# EAGLE design PCB-BI8-1x6SC3 (EAGLE 7.5.0)
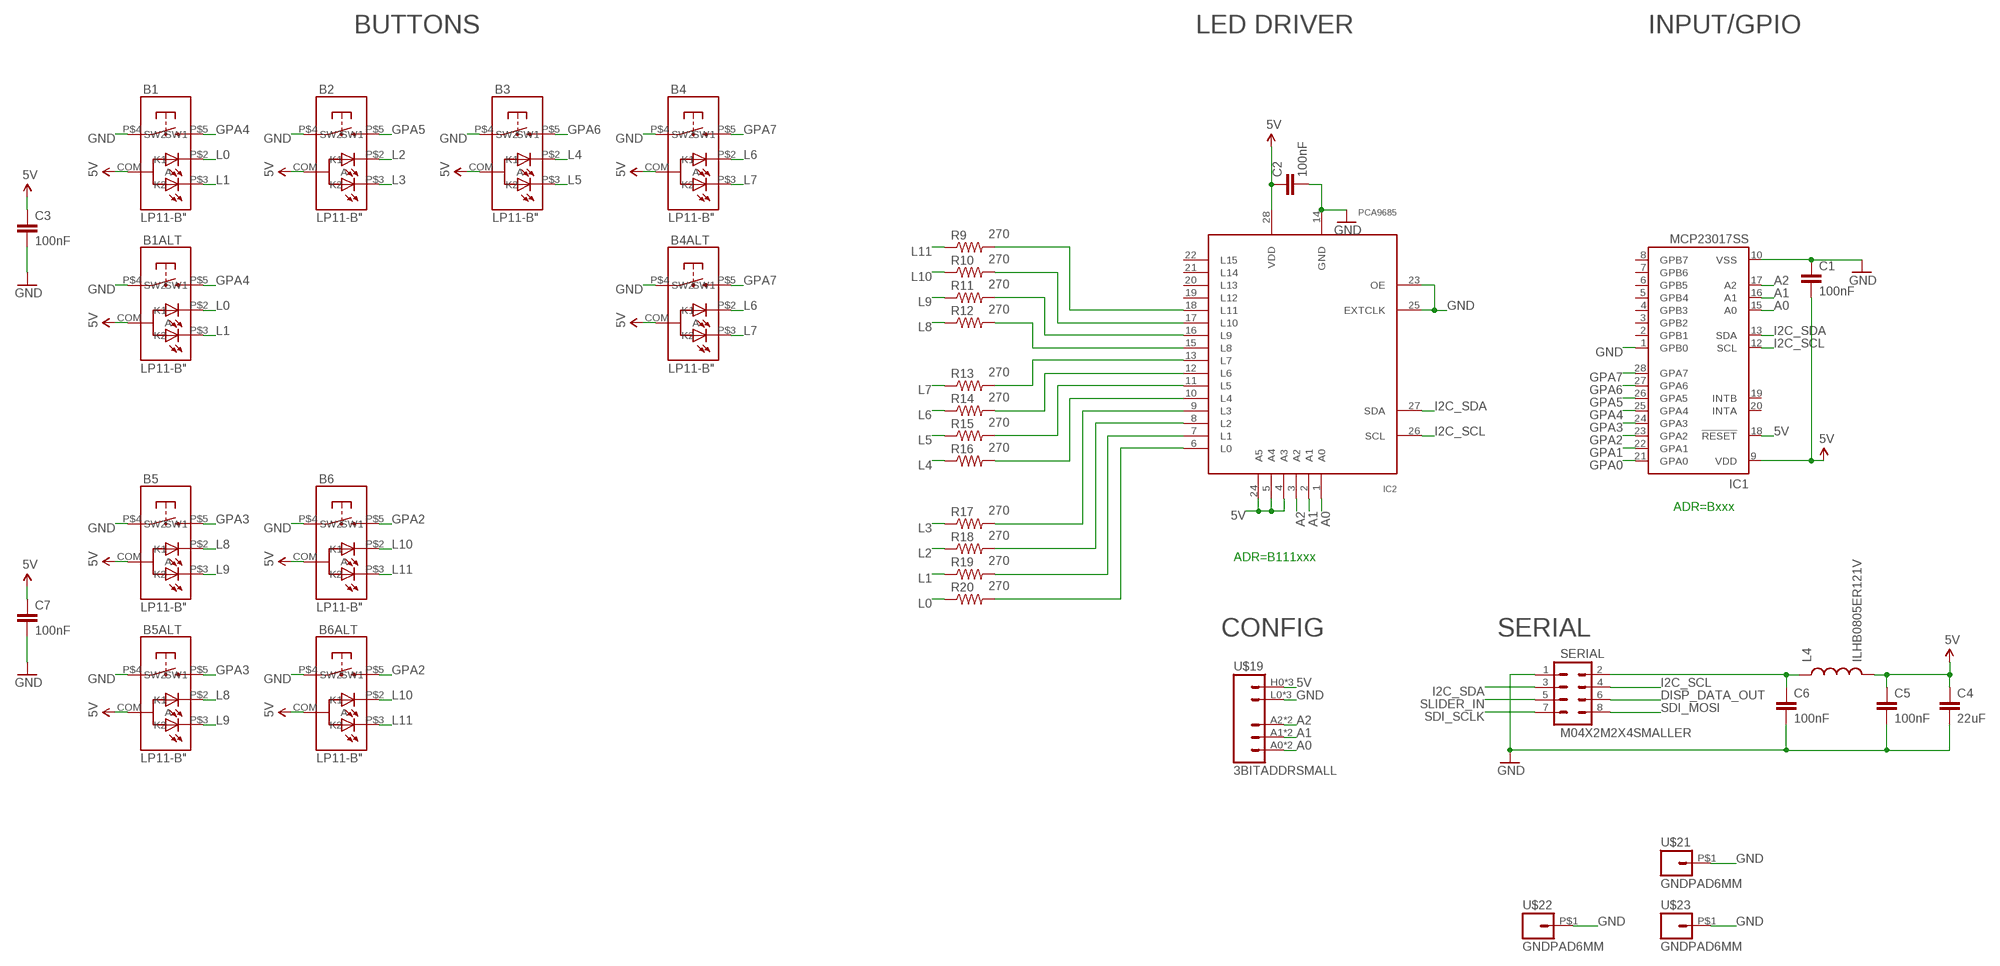
[diagram p0: schematic, sheet 1]

## Parts
B1  LP11-B"  [LP11]
B1ALT  LP11-B"  [LP11]
B2  LP11-B"  [LP11]
B3  LP11-B"  [LP11]
B4  LP11-B"  [LP11]
B4ALT  LP11-B"  [LP11]
B5  LP11-B"  [LP11]
B5ALT  LP11-B"  [LP11]
B6  LP11-B"  [LP11]
B6ALT  LP11-B"  [LP11]
C1  100nF  CAP0603-CAP  [0603-CAP]
C2  100nF  CAP0603-CAP  [0603-CAP]
C3  100nF  CAP0603-CAP  [0603-CAP]
C4  22uF  CAP0805  [0805]
C5  100nF  CAP0603-CAP  [0603-CAP]
C6  100nF  CAP0603-CAP  [0603-CAP]
C7  100nF  CAP0603-CAP  [0603-CAP]
IC1  MCP23017SS  [SSOP28]
IC2  PCA9685  [TSSOP28]
L4  ILHB0805ER121V  INDUCTOR0805  [0805]
R9  270  RESISTOR0603-RES  [0603-RES]
R10  270  RESISTOR0603-RES  [0603-RES]
R11  270  RESISTOR0603-RES  [0603-RES]
R12  270  RESISTOR0603-RES  [0603-RES]
R13  270  RESISTOR0603-RES  [0603-RES]
R14  270  RESISTOR0603-RES  [0603-RES]
R15  270  RESISTOR0603-RES  [0603-RES]
R16  270  RESISTOR0603-RES  [0603-RES]
R17  270  RESISTOR0603-RES  [0603-RES]
R18  270  RESISTOR0603-RES  [0603-RES]
R19  270  RESISTOR0603-RES  [0603-RES]
R20  270  RESISTOR0603-RES  [0603-RES]
SERIAL  M04X2M2X4SMALLER  [M2X4SMALLER]
U$19  3BITADDRSMALL  [3BITADDR_SMALL]
U$21  GNDPAD6MM  [3.2MMPAD6MM]
U$22  GNDPAD6MM  [3.2MMPAD6MM]
U$23  GNDPAD6MM  [3.2MMPAD6MM]

## Nets
5V [Power]: B1.COM(A) B1ALT.COM(A) B2.COM(A) B3.COM(A) B4.COM(A) B4ALT.COM(A) B5.COM(A) B5ALT.COM(A) B6.COM(A) B6ALT.COM(A) C1.2 C2.1 C3.1 C4.1 C5.1 C7.1 IC1.9(VDD) IC1.18(!RESET) IC2.4(A3) IC2.5(A4) IC2.24(A5) IC2.28(VDD) L4.2 U$19.H0(VCC) U$19.H1(VCC) U$19.H2(VCC)
A0: IC1.15(A0) IC2.1(A0) U$19.A0 U$19.AS0(A0)
A1: IC1.16(A1) IC2.2(A1) U$19.A1 U$19.AS1(A1)
A2: IC1.17(A2) IC2.3(A2) U$19.A2 U$19.AS2(A2)
DISP_DATA_OUT: SERIAL.6
GND [Power]: B1.P$4(SW1) B1ALT.P$4(SW1) B2.P$4(SW1) B3.P$4(SW1) B4.P$4(SW1) B4ALT.P$4(SW1) B5.P$4(SW1) B5ALT.P$4(SW1) B6.P$4(SW1) B6ALT.P$4(SW1) C1.1 C2.2 C3.2 C4.2 C5.2 C6.2 C7.2 IC1.1(GPB0) IC1.10(VSS) IC2.14(GND) IC2.23(OE) IC2.25(EXTCLK) SERIAL.1 U$19.L0(GND) U$19.L1(GND) U$19.L2(GND) U$21.P$1 U$22.P$1 U$23.P$1
GPA0: IC1.21(GPA0)
GPA1: IC1.22(GPA1)
GPA2: B6.P$5(SW2) B6ALT.P$5(SW2) IC1.23(GPA2)
GPA3: B5.P$5(SW2) B5ALT.P$5(SW2) IC1.24(GPA3)
GPA4: B1.P$5(SW2) B1ALT.P$5(SW2) IC1.25(GPA4)
GPA5: B2.P$5(SW2) IC1.26(GPA5)
GPA6: B3.P$5(SW2) IC1.27(GPA6)
GPA7: B4.P$5(SW2) B4ALT.P$5(SW2) IC1.28(GPA7)
I2C_SCL: IC1.12(SCL) IC2.26(SCL) SERIAL.4
I2C_SDA: IC1.13(SDA) IC2.27(SDA) SERIAL.3
L0: B1.P$2(K1) B1ALT.P$2(K1) R20.1
L1: B1.P$3(K2) B1ALT.P$3(K2) R19.1
L2: B2.P$2(K1) R18.1
L3: B2.P$3(K2) R17.1
L4: B3.P$2(K1) R16.1
L5: B3.P$3(K2) R15.1
L6: B4.P$2(K1) B4ALT.P$2(K1) R14.1
L7: B4.P$3(K2) B4ALT.P$3(K2) R13.1
L8: B5.P$2(K1) B5ALT.P$2(K1) R12.1
L9: B5.P$3(K2) B5ALT.P$3(K2) R11.1
L10: B6.P$2(K1) B6ALT.P$2(K1) R10.1
L11: B6.P$3(K2) B6ALT.P$3(K2) R9.1
N$1 [Power]: C6.1 L4.1 SERIAL.2
N$4: IC2.13(L7) R13.2
N$5: IC2.12(L6) R14.2
N$7: IC2.11(L5) R15.2
N$9: IC2.10(L4) R16.2
N$10: IC2.9(L3) R17.2
N$11: IC2.8(L2) R18.2
N$12: IC2.7(L1) R19.2
N$19: IC2.6(L0) R20.2
N$20: IC2.15(L8) R12.2
N$21: IC2.16(L9) R11.2
N$22: IC2.17(L10) R10.2
N$23: IC2.18(L11) R9.2
SDI_MOSI: SERIAL.8
SDI_SCLK: SERIAL.7
SLIDER_IN: SERIAL.5
Unconnected: IC1.2(GPB1) IC1.3(GPB2) IC1.4(GPB3) IC1.5(GPB4) IC1.6(GPB5) IC1.7(GPB6) IC1.8(GPB7) IC1.19(INTB) IC1.20(INTA) IC2.19(L12) IC2.20(L13) IC2.21(L14) IC2.22(L15)

## Notes on the sheet
- BUTTONS | LED DRIVER | INPUT/GPIO
- ADR=Bxxx
- ADR=B111xxx
- CONFIG | SERIAL

## Library data of the parts
B1 B1ALT B2-B4 B4ALT B5 B5ALT B6 B6ALT = SKAARHOJ:LP11-B
C1-C7 = SparkFun:CAP: Capacitor Standard 0603 ceramic capacitor, and 0.1" leaded capacitor.
IC1 = microchip:MCP23017: http://ww1.microchip.com/downloads/en/DeviceDoc/21952a.pdf Source: http://ww1.microchip.com/downloads/en/DeviceDoc/21952a.pdf; MF: MICROCHIP; MPN: MCP23017-E/SS; OC_FARNELL: 1467674; OC_NEWARK: 31K2960
IC2 = wsmith:PCA9685
L4 = SparkFun:INDUCTOR: Inductors Basic Inductor/Choke - 0603 and 1206. Footprints are not proven and vary greatly between part numbers.
R9-R20 = SparkFun:RESISTOR: Resistor Basic schematic elements and footprints for 0603, 1206, and PTH resistors.
SERIAL = SKAARHOJ:M04X2
U$19 = SKAARHOJ:3BITADDR
U$21-U$23 = SKAARHOJ:GNDPAD

## Net classes
0 default: width 0.203 mm, drill 0.406 mm, clearance 0.203 mm
1 Power: width 0.406 mm, drill 0.61 mm, clearance 0.203 mm

## Board
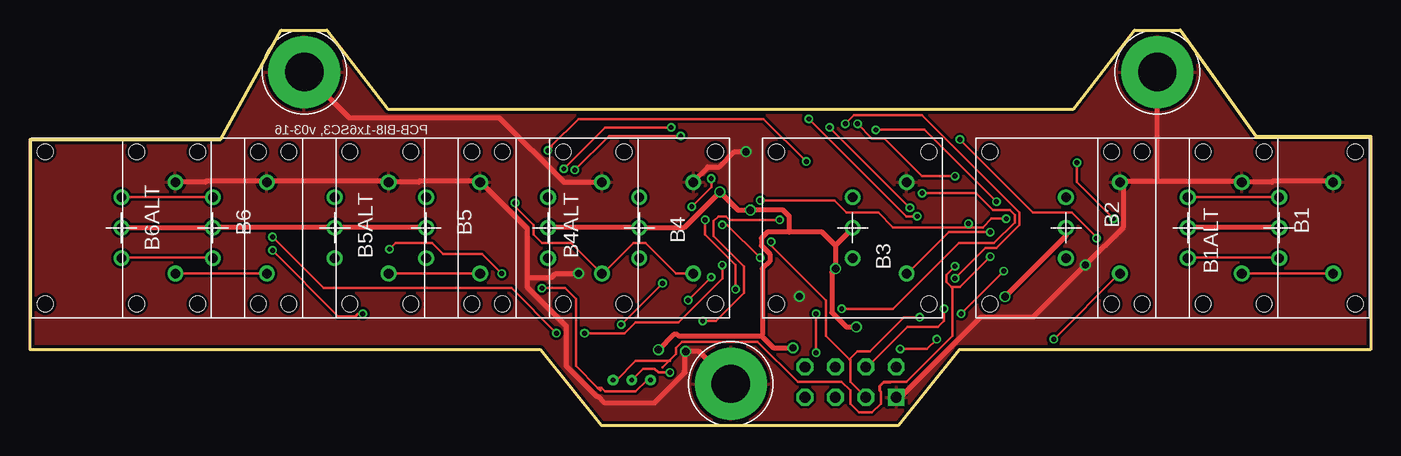
[diagram p1: board, top side]
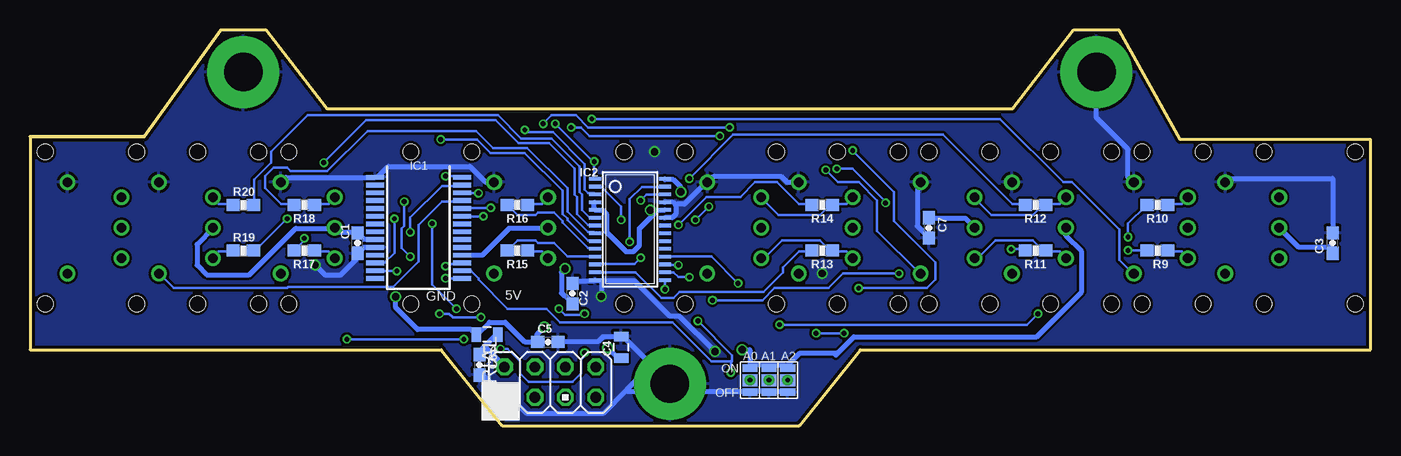
[diagram p2: board, bottom side, seen from below]

Size 111.76 x 33.02 mm. Coordinates in mm from the lower left corner, seen from the top.
Outline: 0,23.88 15.88,23.88 20.95,33.02 24.77,33.02 29.84,26.42 87,26.42 92.08,33.02 95.89,33.02 102.23,24.13 111.76,24.13 111.76,6.35 77.47,6.35 72.39,0 47.62,0 42.55,6.35 0,6.35 0,23.88
Copper layers (1*16): Top 0.035mm / dielectric 1.5mm / Bottom 0.035mm
Design rules "Fusion_eagle_rule_v1.1": minimum track width 6mil, minimum drill 12mil, track to track 6mil, track to pad 6mil, pad to pad 6mil, via to via 6mil, smd to smd 0mil, copper to edge 10mil, drill to drill 10mil, minimum pad ring 10mil, minimum via ring 6mil, stop-mask expansion 2mil, vias tented up to drill 100mil, thermal gap 10mil

### Footprints (pad centres in the part's own frame; a part is rotated, then mirrored left to right if it is on the bottom)
LP11 = drill 0.8: COM 0,0; P$2 0,2.54; P$3 0,-2.54; P$4 4.5,3.81; P$5 4.5,-3.81 | hole 1.3: -6.35,6.35; 6.35,6.35; 6.35,-6.35; -6.35,-6.35
0603-CAP = smd 1.1 x 1: 1 -0.85,0; 2 0.85,0
0805 = smd 0.8 x 1.2: 1 -0.9,0; 2 0.9,0
SSOP28 = smd 0.4 x 1.5: 1 -4.225,-3.625; 2 -3.575,-3.625; 3 -2.925,-3.625; 4 -2.275,-3.625; 5 -1.625,-3.625; 6 -0.975,-3.625; 7 -0.325,-3.625; 8 0.325,-3.625; 9 0.975,-3.625; 10 1.625,-3.625; 11 2.275,-3.625; 12 2.925,-3.625; 13 3.575,-3.625; 14 4.225,-3.625; 15 4.225,3.625; 16 3.575,3.625; 17 2.925,3.625; 18 2.275,3.625; 19 1.625,3.625; 20 0.975,3.625; 21 0.325,3.625; 22 -0.325,3.625; 23 -0.975,3.625; 24 -1.625,3.625; 25 -2.275,3.625; 26 -2.925,3.625; 27 -3.575,3.625; 28 -4.225,3.625
TSSOP28 = smd 0.305 x 0.991: 1 -4.225,-2.918; 2 -3.575,-2.918; 3 -2.925,-2.918; 4 -2.275,-2.918; 5 -1.625,-2.918; 6 -0.975,-2.918; 7 -0.325,-2.918; 8 0.325,-2.918; 9 0.975,-2.918; 10 1.625,-2.918; 11 2.275,-2.918; 12 2.925,-2.918; 13 3.575,-2.918; 14 4.225,-2.918; 15 4.225,2.918; 16 3.575,2.918; 17 2.925,2.918; 18 2.275,2.918; 19 1.625,2.918; 20 0.975,2.918; 21 0.325,2.918; 22 -0.325,2.918; 23 -0.975,2.918; 24 -1.625,2.918; 25 -2.275,2.918; 26 -2.925,2.918; 27 -3.575,2.918; 28 -4.225,2.918
0603-RES = smd 1.1 x 1: 1 -0.85,0; 2 0.85,0
M2X4SMALLER = drill 0.9 square: 1 -1.27,3.81 | drill 0.9 octagon: 2 1.27,3.81; 3 -1.27,1.27; 4 1.27,1.27; 5 -1.27,-1.27; 6 1.27,-1.27; 7 -1.27,-3.81; 8 1.27,-3.81
3BITADDR_SMALL = drill 0.4: A0 -1.565,0; A1 0,0; A2 1.565,0 | smd 1.27 x 1: AS0 -1.565,0; AS1 0,0; AS2 1.565,0 | smd 1.27 x 0.635: H0 -1.565,1; H1 0,1; H2 1.565,1; L0 -1.565,-1; L1 0,-1; L2 1.565,-1
3.2MMPAD6MM = drill 3.2 pad 6: P$1 0,0

### Placement (x,y rotation side)
B1  104.14,16.51 0 top
B1ALT  96.52,16.51 0 top
B2  86.36,16.51 0 top
B3  68.58,16.51 0 top
B4  50.8,16.51 0 top
B4ALT  43.18,16.51 0 top
B5  33.02,16.51 0 top
B5ALT  25.4,16.51 0 top
B6  15.24,16.51 0 top
B6ALT  7.62,16.51 0 top
C1  84.45,15.24 90 bottom
C2  66.55,11.02 90 bottom
C3  3.17,15.24 90 bottom
C4  62.48,6.55 90 bottom
C5  68.58,6.99 0 bottom
C6  74.3,5.08 270 bottom
C7  36.83,16.51 270 bottom
IC1  79.38,16.51 270 bottom
IC2  61.75,16.38 270 bottom
L4  73.66,7.62 180 bottom
R9  17.78,14.61 180 bottom
R10  17.78,18.41 180 bottom
R11  27.94,14.61 180 bottom
R12  27.94,18.41 180 bottom
R13  45.72,14.61 180 bottom
R14  45.72,18.41 180 bottom
R15  71.12,14.61 180 bottom
R16  71.12,18.41 180 bottom
R17  88.9,14.61 180 bottom
R18  88.9,18.41 180 bottom
R19  93.98,14.61 0 bottom
R20  93.98,18.41 0 bottom
SERIAL  68.4,3.63 90 bottom
U$19  50.16,3.81 0 bottom
U$21  58.42,3.5 0 top
U$22  93.98,29.52 0 top
U$23  22.86,29.52 0 top

### Tracks (layer width: path | path; a pad name or v marks a point on that pad's centre or on a via)
5V  (via drill 0.61)
  Top 0.406: B5.COM 33.02,16.56 25.4,16.56 B5ALT.COM 25.3,16.56 15.34,16.56 B6.COM B6ALT.COM | B4ALT.COM 43.18,16.56 50.7,16.56 B4.COM 50.8,16.56 54.56,16.56 v57.51,19.51 59.03,17.98 v60.05,17.98 62.79,17.98 63.3,17.48 63.3,16.15 | B1ALT.COM 96.52,16.56 104.14,16.56 B1.COM | v63.6,6.5 61.98,6.5 60.96,7.52 | 60.96,7.52 54.05,7.52 53.98,7.62 53.66,7.62 v52.39,6.35 | 67.16,15.04 v67.16,13.11 66.85,12.8 66.85,9.45 68.07,8.23 v68.89,8.23 | 67.16,15.04 68.58,16.46 B3.COM | 63.3,16.15 66.04,16.15 67.16,15.04 | 63.3,16.15 61.47,16.15 60.96,15.65 60.96,15.04 61.67,14.33 61.67,13.72 61.06,13.11 61.06,7.62 60.96,7.52 | B2.COM 86.36,15.85 v81.28,10.77
  Bottom 0.406: C7.1 36.78,17.27 33.73,17.27 33.02,16.56 B5.COM | 59.74,17.68 60.96,16.46 60.96,15.04 61.47,14.53 62.08,14.53 63.7,16.15 63.7,17.68 64.01,17.98 64.62,17.98 IC2.5 64.72,18.19 64.72,18.59 IC2.4 | 59.74,17.68 59.44,17.98 58.93,17.98 IC2.24 | v57.51,19.51 57.51,19.91 58.12,20.52 58.83,20.52 IC2.28 | v60.05,17.98 59.74,17.68 | IC1.9 83.92,15.54 84.43,16.05 C1.2 84.63,16.15 86.06,16.15 86.36,16.46 B2.COM 86.46,16.46 89.61,16.46 93.47,12.6 97.03,12.6 97.84,13.41 97.84,15.14 96.52,16.46 B1ALT.COM | v63.6,6.5 62.79,5.69 62.48,5.69 C4.1 | v67.16,13.11 67.46,12.8 67.46,11.07 67.26,10.87 67.16,10.87 66.55,10.26 C2.1 | IC1.18 75.69,14.22 74.07,14.22 71.83,16.46 68.58,16.46 B3.COM | v68.89,8.23 69.49,7.62 69.49,7.21 C5.1 69.49,7.01 70.51,7.01 72.14,8.64 73.46,8.64 74.47,7.62 L4.2 74.68,7.72 74.98,8.03 79.45,8.03 81.28,9.86 v81.28,10.77 | B5ALT.COM 25.4,15.85 24.08,14.53 24.08,11.18 27.84,7.42 43.08,7.42 44.46,6.04 | 44.6,5.89 44.46,6.04 | B6ALT.COM 6.03,14.92 3.49,14.92 3.17,14.61 C3.1 | 50.16,5.08 48.9,5.08 U$19.H2 48.58,5.08 47.62,6.03 44.45,6.03 44.46,6.04 | 50.16,5.08 51.44,5.08 U$19.H0 51.75,5.08 51.75,6.35 v52.39,6.35 | 50.16,5.08 U$19.H1
A0  (via drill 0.41)
  Top 0.203: v67.97,25.2 68.68,25.91 74.37,25.91 82.5,17.78 82.5,16.76 80.57,14.83 79.65,14.83 v77.11,12.29 | 47.31,3.18 45.52,4.98 45.52,10.57 44.6,11.48 v42.67,11.48 | 47.31,3.18 47.55,2.95 | v43.18,22.96 43.48,23.27 43.48,23.37 45.72,25.6 61.16,25.6 v64.72,22.05 | U$19.AS0 51.44,3.81 50.48,2.86 47.94,2.86 47.62,3.17 47.31,3.17 47.31,3.18
  Bottom 0.203: v67.97,25.2 64.77,22 | 64.77,22 64.72,21.95 64.72,20.62 IC2.1 | v77.11,12.29 75.79,12.29 IC1.15 | v42.67,11.48 36.98,11.48 36.27,12.19 36.27,13.61 39.73,17.07 39.73,19.51 v43.18,22.96 | v64.72,22.05 64.77,22 | 51.75,3.81 U$19.AS0
A1  (via drill 0.41)
  Top 0.203: v62.48,17.17 58.32,17.17 58.01,17.48 57.4,17.48 57,17.07 57,15.85 59.54,13.31 59.54,11.07 57.2,8.74 v56.08,8.74 | U$19.AS1 51.12,4.76 52.07,4.76 52.39,4.45 v53.34,4.45
  Bottom 0.203: v62.48,17.17 62.48,18.29 64.11,19.91 64.62,19.91 IC2.2 | v56.08,8.74 53.24,5.89 53.24,5.38 53.34,5.38 | 53.34,5.38 54.97,5.38 58.22,8.64 67.56,8.64 68.68,9.75 71.93,9.75 74.37,12.19 74.37,12.29 74.98,12.9 75.69,12.9 IC1.16 | 53.34,5.38 v53.34,4.45 | 53.34,5.4 53.34,5.38
A2  (via drill 0.41)
  Top 0.203: v70.51,24.69 74.57,24.69 v80.57,18.69 | v80.06,14.12 77.52,11.58 76.91,11.58 | 76.91,11.58 76.81,11.58 76.4,11.99 76.4,12.6 v77.11,13.31 | 53.3,5.44 53.85,5.99 53.85,6.5 54.36,7.01 60.66,7.01 64.01,3.66 67.67,3.66 68.38,2.95 68.38,1.83 69.09,1.12 70.21,1.12 70.92,1.83 70.92,2.85 | 53.3,5.44 52.73,4.88 | 71.73,3.66 73.05,3.66 76.91,7.52 76.91,11.58 | U$19.AS2 48.9,3.81 50.48,5.4 53.34,5.4 53.3,5.44
  Top 0.254: 70.92,2.85 70.87,2.9 70.87,3.35 71.17,3.66 71.73,3.66
  Bottom 0.203: v70.51,24.69 70.31,24.49 68.17,24.49 65.53,21.84 65.53,19.71 65.23,19.41 64.72,19.41 IC2.3 | v80.57,18.69 80.57,16.66 80.77,16.46 80.77,14.83 v80.06,14.12 | v77.11,13.31 76.81,13.31 76.61,13.51 75.79,13.51 IC1.17 | 48.9,3.81 U$19.AS2
GND  (via drill 0.6, 0.61)
  Top 0.406: U$21.P$1 58.42,3.56 55.78,6.2 v54.66,6.2 54.56,6.1 54.56,4.57 54.61,4.45 52.07,1.91 47.94,1.91 47.85,1.93 47.35,2.44 47.24,2.44 44.7,4.98 44.7,8.33 41.45,11.58 41.45,12.38 | B1.P$4 108.61,20.32 108.51,20.42 103.63,20.42 103.53,20.32 B1ALT.P$4 100.89,20.42 93.98,20.42 | 93.98,20.42 91.44,20.42 91.24,20.22 B2.P$4 90.93,20.32 91.14,20.12 91.14,16.56 v87.99,13.41 83.62,9.04 79.25,9.04 72.64,2.44 72.24,2.44 SERIAL.1 | 93.98,20.42 U$22.P$1 | B4ALT.P$4 44.5,20.32 39.12,25.7 26.62,25.7 22.86,29.46 U$23.P$1 | B6ALT.P$4 14.63,20.32 14.73,20.42 19.61,20.42 19.71,20.32 B6.P$4 19.91,20.42 29.77,20.42 B5ALT.P$4 32.41,20.32 32.51,20.42 37.39,20.42 37.49,20.32 B5.P$4 37.69,20.22 41.45,16.46 41.45,12.38 | v45.72,12.7 43.81,12.7 43.5,12.38 41.45,12.38 | v59.69,22.86 58.74,22.86 57.47,21.59 56.52,21.59 55.24,20.32 B4.P$4
  Bottom 0.406: C6.2 74.27,4.17 73.97,4.17 72.24,2.44 SERIAL.1 72.03,2.34 71.63,2.34 70.31,1.02 64.01,1.02 62.04,2.98 | C5.2 67.67,7.01 64.41,7.01 64.01,7.42 62.48,7.42 C4.2 62.38,7.32 62.18,7.32 58.42,3.56 U$21.P$1 60.05,4.98 62.04,2.98 | C2.2 66.55,11.89 66.34,12.09 64.72,12.09 IC2.14 64.52,12.09 64.14,12.09 | 64.14,12.09 61.37,12.09 58.42,9.14 57.61,9.14 v54.66,6.2 | v87.99,13.41 87.17,12.6 85.85,12.6 84.53,13.92 84.53,14.33 C1.1 83.96,14.88 IC1.10 | B2.P$4 90.83,20.32 90.42,20.73 IC1.1 82.8,20.73 81.89,21.64 75.08,21.64 73.76,20.32 B3.P$4 | 57.91,18.39 57.91,17.68 58.22,17.37 58.83,17.37 IC2.23 | 57.91,18.39 58.22,18.69 58.83,18.69 IC2.25 | 57.91,18.39 57.81,18.49 57.2,18.49 55.37,20.32 B4.P$4 55.17,20.42 54.76,20.83 49.17,20.83 48.67,20.32 B4ALT.P$4 | C7.2 36.88,15.75 37.8,16.66 37.8,20.12 37.59,20.32 B5.P$4 | U$23.P$1 22.86,25.7 20.22,23.06 20.22,20.73 19.81,20.32 B6.P$4 | 64.14,12.09 v64.14,10.79 | C3.2 3.17,20.64 11.75,20.64 12.06,20.32 B6ALT.P$4 | 50.16,2.86 48.9,2.86 U$19.L2 | 50.16,2.86 51.44,2.86 U$19.L0 51.75,2.86 61.91,2.86 62.04,2.98 | 50.16,2.86 U$19.L1
  pour Bottom: 0,0 111.76,0 111.76,33.02 0,33.02
  pour Top: 0,0 111.76,0 111.76,33.02 0,33.02
GPA2  (via drill 0.41)
  Top 0.203: v73.97,17.48 73.05,17.48 v64.92,25.6 | B6.P$5 B6ALT.P$5
  Bottom 0.203: v73.97,17.48 75.69,17.48 IC1.23 | v64.92,25.6 30.89,25.6 25.6,20.32 24.89,20.32 20.93,16.36 20.93,13.82 19.81,12.7 B6.P$5
GPA3  (via drill 0.41)
  Top 0.203: v66.65,24.89 v73.36,18.19 | v54.25,24.18 48.26,24.18 v45.41,21.34 | B5.P$5 B5ALT.P$5
  Bottom 0.203: v73.36,18.19 75.69,18.19 IC1.24 | v66.65,24.89 65.84,24.89 65.13,24.18 v54.25,24.18 | v45.41,21.34 44.4,20.32 42.67,20.32 41.15,18.8 41.15,16.26 37.59,12.7 B5.P$5
GPA4
  Top 0.203: B1ALT.P$5 B1.P$5
  Bottom 0.203: IC1.25 75.79,18.69 77.42,18.69 79.35,16.76 79.35,13.72 81.48,11.58 90.22,11.58 90.32,11.48 99.77,11.48 100.99,12.7 B1ALT.P$5
GPA5  (via drill 0.41)
  Top 0.203: v74.37,19.41 78.84,19.41 80.26,17.98 81.69,17.98 82.09,17.58 82.09,16.97 80.37,15.24 77.42,15.24 71.93,9.75 v67.67,9.75 | v65.53,6.1 v65.53,9.35 | v72.54,6.4 74.78,6.4 v75.59,7.21 | v85.34,7.21 90.83,12.7 B2.P$5
  Bottom 0.203: v74.37,19.41 75.69,19.41 IC1.26 | v67.67,9.75 67.16,9.25 65.63,9.25 v65.53,9.35 | v65.53,6.1 65.53,5.79 65.84,5.49 65.84,4.37 66.55,3.66 70.21,3.66 70.92,4.37 70.92,5.38 71.93,6.4 v72.54,6.4 | v85.34,7.21 v75.59,7.21
GPA6  (via drill 0.41)
  Top 0.203: v80.06,16.15 76.61,16.15 73.15,12.7 B3.P$5
  Bottom 0.203: v80.06,16.15 80.06,17.37 77.42,20.02 75.79,20.02 IC1.27
GPA7  (via drill 0.41)
  Top 0.203: v77.11,20.83 74.37,20.83 71.22,23.98 70.21,23.98 v68.99,25.2 | v53.44,24.89 47.95,24.89 v44.5,21.44 | v40.44,18.59 40.44,18.29 41.96,16.76 41.96,15.95 42.67,15.24 45.11,15.24 47.65,12.7 B4ALT.P$5 47.75,12.7 50.29,15.24 51.31,15.24 53.85,12.7 B4.P$5
  Bottom 0.203: v77.11,20.83 75.79,20.83 IC1.28 | v68.99,25.2 68.28,25.91 66.24,25.91 65.23,24.89 v53.44,24.89 | v44.5,21.44 43.18,21.44 40.44,18.69 v40.44,18.59
I2C_SCL  (via drill 0.41)
  Top 0.203: v60.86,18.8 67.06,18.8 68.07,17.78 70.71,17.78 71.93,16.56 78.23,16.56 | 78.23,16.56 79.45,16.56 80.16,17.27 v81.38,17.27 | v76.2,9.75 76.2,8.74 75.69,8.23 73.15,8.23 69.9,4.98 69.7,4.98 SERIAL.4 | 78.23,16.56 v78.23,16.87
  Bottom 0.203: v60.86,18.8 60.35,19.3 58.93,19.3 IC2.26 | v81.38,17.27 81.38,14.43 82.19,13.61 82.91,13.61 IC1.12 | v76.2,9.75 78.23,11.79 v78.23,16.87
I2C_SDA  (via drill 0.41)
  Top 0.203: v61.77,15.34 61.77,15.04 66.34,10.46 66.34,7.52 68.33,5.54 | 68.33,5.54 68.38,5.49 68.38,3.66 SERIAL.3 | v77.62,9.35 v81.18,12.9 | v74.17,9.04 72.85,9.04 70,6.2 68.99,6.2 68.33,5.54
  Bottom 0.203: v61.77,15.34 61.77,18.9 60.76,19.91 58.93,19.91 IC2.27 | v81.18,12.9 82.91,12.9 IC1.13 | v77.62,9.35 76.81,9.35 76.5,9.04 v74.17,9.04
L0
  Top 0.203: B1ALT.P$2 96.52,19.1 104.14,19.1 B1.P$2
  Bottom 0.203: R20.1 94.89,18.49 96.01,18.49 96.52,19 B1ALT.P$2
L1
  Top 0.203: B1ALT.P$3 96.52,14.02 104.14,14.02 B1.P$3
  Bottom 0.203: R19.1 94.89,14.53 96.01,14.53 96.52,14.02 B1ALT.P$3
L2
  Bottom 0.203: R18.1 87.99,18.49 86.87,18.49 86.36,19 B2.P$2
L3
  Bottom 0.203: R17.1 87.99,14.53 86.87,14.53 86.36,14.02 B2.P$3
L4
  Bottom 0.203: R16.1 70.21,18.49 69.09,18.49 68.58,19 B3.P$2
L5
  Bottom 0.203: R15.1 70.21,14.53 69.09,14.53 68.58,14.02 B3.P$3
L6
  Bottom 0.203: B4ALT.P$2 43.18,19 43.69,18.49 44.81,18.49 R14.1 44.91,18.39 45.11,18.39 45.92,17.58 49.38,17.58 50.8,19 B4.P$2
L7
  Bottom 0.203: B4ALT.P$3 43.18,14.02 43.69,14.53 44.81,14.53 R13.1 44.91,14.63 45.11,14.63 45.92,15.44 49.07,15.44 50.49,14.02 50.8,14.02 B4.P$3
L8
  Bottom 0.203: B5ALT.P$2 25.4,19 25.91,18.49 27.03,18.49 R12.1 27.13,18.39 27.33,18.39 28.14,17.58 31.6,17.58 33.02,19 B5.P$2
L9
  Bottom 0.203: B5ALT.P$3 25.4,14.02 25.91,14.53 27.03,14.53 R11.1 27.13,14.63 27.33,14.63 28.14,15.44 31.29,15.44 32.72,14.02 33.02,14.02 B5.P$3
L10
  Top 0.203: B6ALT.P$2 7.62,19.1 15.24,19.1 B6.P$2
  Bottom 0.203: R10.1 16.87,18.49 15.75,18.49 15.24,19 B6.P$2
L11
  Top 0.203: B6ALT.P$3 7.62,14.02 15.24,14.02 B6.P$3
  Bottom 0.203: R9.1 16.87,14.53 15.75,14.53 15.24,14.02 B6.P$3
N$1
  Bottom 0.406: 73.86,6.6 72.85,7.62 L4.1 | 73.86,6.6 74.27,6.2 74.27,5.99 C6.1 | 73.86,6.6 72.24,4.98 SERIAL.2
N$4
  Bottom 0.203: IC2.13 64.62,12.8 61.27,12.8 59.13,10.67 58.12,10.67 57.61,11.18 50.6,11.18 48.97,12.8 48.97,13.21 47.65,14.53 46.63,14.53 R13.2
N$5  (via drill 0.41)
  Top 0.203: v60.86,14.02 58.12,16.76 v57.71,16.76
  Bottom 0.203: v60.86,14.02 61.37,13.51 64.62,13.51 IC2.12 | v57.71,16.76 55.37,19.1 52.53,19.1 51.31,20.32 49.48,20.32 47.65,18.49 46.63,18.49 R14.2
N$7
  Bottom 0.203: IC2.11 64.72,14.12 66.95,14.12 68.07,15.24 69.39,15.24 69.6,15.44 71.12,15.44 71.93,14.63 R15.2
N$9
  Bottom 0.203: IC2.10 64.72,14.83 65.23,14.83 67.36,16.97 67.36,17.07 68.07,17.78 69.39,17.78 69.6,17.58 71.12,17.58 71.93,18.39 R16.2
N$10  (via drill 0.41)
  Top 0.203: v77.52,23.88 83.62,17.78 86.87,17.78 88.9,15.75 v88.9,15.65
  Bottom 0.203: v77.52,23.88 74.47,23.88 73.36,22.76 70.51,22.76 67.36,19.61 67.36,17.68 66.95,17.27 66.95,17.17 65.23,15.44 64.72,15.44 IC2.9 | v88.9,15.65 88.9,15.44 89.71,14.63 R17.2
N$11
  Bottom 0.203: IC2.8 64.72,16.15 65.23,16.15 66.95,17.88 66.95,19.81 70.31,23.16 73.15,23.16 74.57,24.59 83.62,24.59 86.97,21.23 90.02,21.23 90.32,21.54 91.44,21.54 92.15,20.83 92.15,19.81 90.83,18.49 89.81,18.49 R18.2
N$12  (via drill 0.41)
  Top 0.203: v87.27,21.95 87.27,20.32 v90.32,17.27
  Bottom 0.203: v87.27,21.95 83.72,25.5 72.95,25.5 71.02,23.57 68.48,23.57 66.34,21.44 66.34,19.3 66.14,19.1 66.14,17.68 65.23,16.76 64.72,16.76 IC2.7 | v90.32,17.27 93.07,14.53 R19.2
N$19
  Bottom 0.203: IC2.6 64.72,17.37 65.13,17.37 65.73,17.98 65.73,19.3 65.94,19.51 65.94,21.64 68.28,23.98 70.81,23.98 72.75,25.91 88.59,25.91 91.64,22.86 91.64,21.95 93.07,20.52 93.07,18.49 R20.2
N$20  (via drill 0.41)
  Top 0.203: v58.83,11.38 58.83,13.41 56.29,15.95 v56.29,17.17 | v55.17,18.29 56.79,19.91 v56.79,20.62
  Bottom 0.203: v58.83,11.38 58.83,12.09 IC2.15 | v55.17,18.29 v56.29,17.17 | v56.79,20.62 53.14,24.28 35.66,24.28 29.87,18.49 28.85,18.49 R12.2
N$21  (via drill 0.41)
  Top 0.203: v54.86,10.46 v56.79,12.39 | v39.32,12.7 37.69,14.33 34.44,14.33 33.53,15.24 30.48,15.24 v29.97,14.73
  Bottom 0.203: v56.79,12.39 57.71,12.39 58.12,12.8 IC2.16 | v54.86,10.46 50.7,10.46 49.68,11.48 45.21,11.48 43.99,12.7 v39.32,12.7 | v29.97,14.73 28.96,14.73 28.85,14.63 R11.2
N$22  (via drill 0.41)
  Top 0.203: v57.71,13.41 57.71,12.29 54.05,8.64 50.49,8.64 49.58,7.72 v46.23,7.72 | v43.89,7.72 40.13,11.48 24.49,11.48 v20.22,15.75
  Bottom 0.203: v57.71,13.41 58.83,13.41 IC2.17 | v43.89,7.72 v46.23,7.72 | v20.22,15.75 20.22,16.87 18.69,18.39 R10.2
N$23  (via drill 0.41)
  Top 0.203: v49.28,8.43 v52.73,11.89 | v27.74,9.35 27.33,9.35 27.13,9.14 25.7,9.14 v20.22,14.63
  Bottom 0.203: v52.73,11.89 54.97,14.12 58.83,14.12 IC2.18 | v49.28,8.43 28.65,8.43 v27.74,9.35 | v20.22,14.63 18.69,14.63 R9.2

### Text on the board
_tsilk: PCB-BI8-1x6SC3, v03-16
_bsilk: GND | 5V